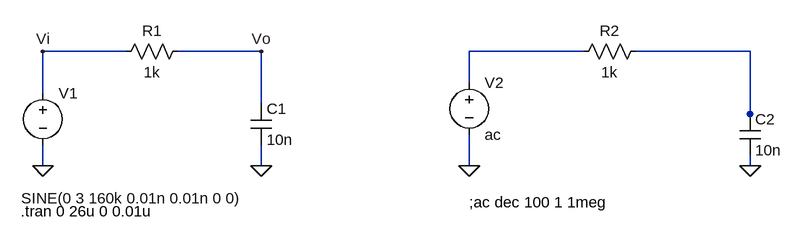
[diagram p0: schematic filtroRC_altafrecuencia_seno.asc]
filtroRC_altafrecuencia_seno.asc, the LTspice schematic file:
Version 4
SHEET 1 1256 680
WIRE 240 16 112 16
WIRE 448 16 320 16
WIRE 944 16 768 16
WIRE 1200 16 1024 16
WIRE 768 64 768 16
WIRE 112 80 112 16
WIRE 448 96 448 16
WIRE 1200 112 1200 16
WIRE 1200 128 1200 112
WIRE 112 192 112 160
WIRE 448 192 448 160
WIRE 768 192 768 144
WIRE 1200 192 1200 176
FLAG 112 192 0
FLAG 448 192 0
FLAG 112 16 Vi
FLAG 448 16 Vo
FLAG 768 192 0
FLAG 1200 192 0
SYMBOL voltage 112 64 R0
WINDOW 3 -33 178 Left 2
WINDOW 123 0 0 Left 0
WINDOW 39 0 0 Left 0
SYMATTR InstName V1
SYMATTR Value SINE(0 3 160k 0.01n 0.01n 0 0)
SYMBOL res 336 0 R90
WINDOW 0 0 56 VBottom 2
WINDOW 3 32 56 VTop 2
SYMATTR InstName R1
SYMATTR Value 1k
SYMBOL cap 432 96 R0
SYMATTR InstName C1
SYMATTR Value 10n
SYMBOL voltage 768 48 R0
SYMATTR InstName V2
SYMATTR Value ac
SYMBOL res 1040 0 R90
WINDOW 0 0 56 VBottom 2
WINDOW 3 32 56 VTop 2
SYMATTR InstName R2
SYMATTR Value 1k
SYMBOL cap 1184 112 R0
SYMATTR InstName C2
SYMATTR Value 10n
TEXT 78 262 Left 2 !.tran 0 26u 0 0.01u
TEXT 768 248 Left 2 !;ac dec 100 1 1meg

The netlist it stands for:
* filtroRC_altafrecuencia_seno.asc
V1 Vi 0 SINE(0 3 160k 0.01n 0.01n 0 0)
R1 Vo Vi 1k
C1 Vo 0 10n
V2 N001 0 ac
R2 N002 N001 1k
C2 N002 0 10n
.tran 0 26u 0 0.01u
;ac dec 100 1 1meg
.backanno
.end

* Results of the author's LTspice run, read from the files saved beside the schematic
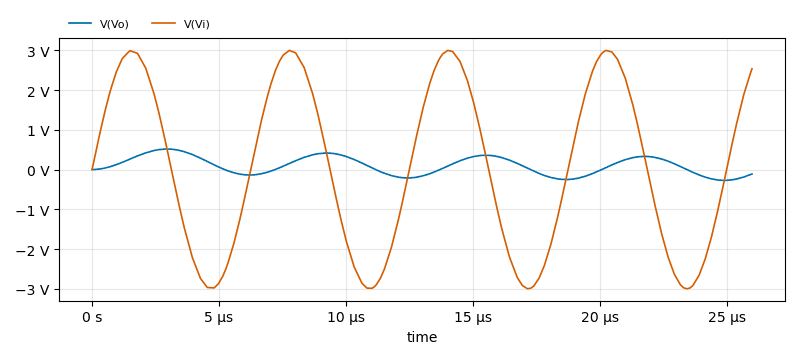
[diagram p1: Transient Analysis of filtroRC_altafrecuencia_seno.asc, plotted from the saved traces]
* Transient Analysis, 1 run:
*   V(Vo): min -272.4 mV, max 516.1 mV, average 96.11 mV, rms 246.9 mV, last -111.6 mV
*   V(Vi): min -3 V, max 2.998 V, average 52.48 mV, rms 2.1 V, last 2.533 V